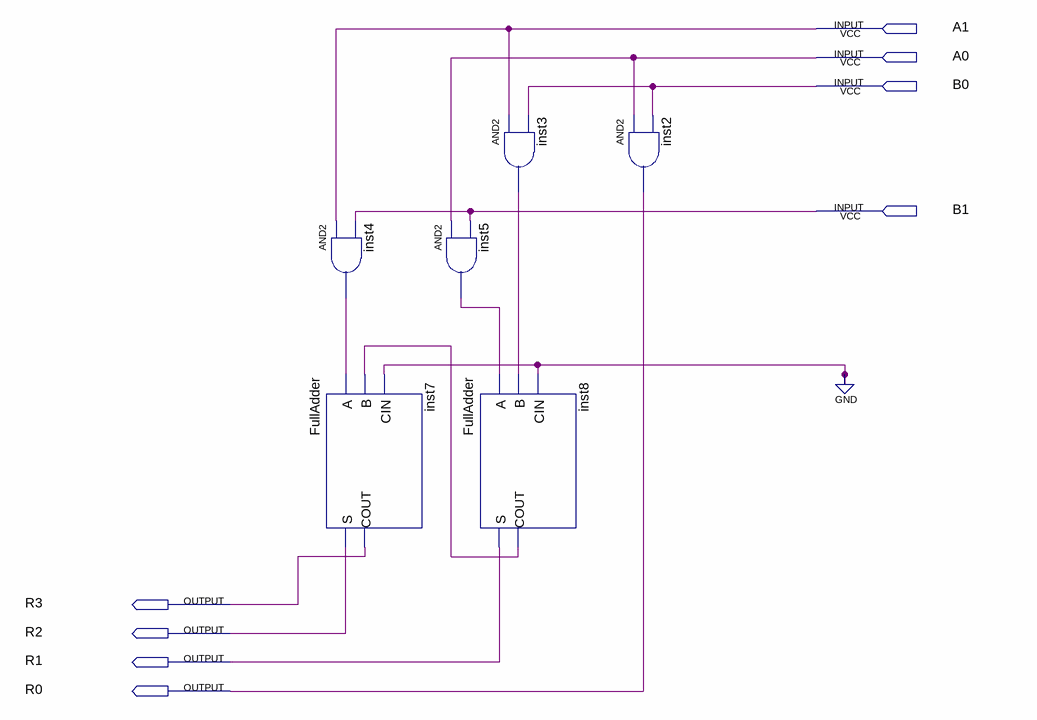
[diagram p0: schematic sheet]
// Quartus schematic mult2bits.bdf as structural Verilog: 6 symbols, 8 pins
module mult2bits (
  input  A1,
  input  A0,
  input  B0,
  input  B1,
  output R3,
  output R2,
  output R1,
  output R0
);

  wire inst3_out, inst4_out, inst5_out, inst8_cout;

  and inst4 (inst4_out, A1, B1);
  FullAdder inst7 (.A(inst4_out), .B(inst8_cout), .CIN(1'b0), .S(R2), .COUT(R3));
  and inst5 (inst5_out, A0, B1);
  FullAdder inst8 (.A(inst5_out), .B(inst3_out), .CIN(1'b0), .S(R1), .COUT(inst8_cout));
  and inst3 (inst3_out, A1, B0);
  and inst2 (R0, A0, B0);
endmodule
